# EAGLE design VIVA Blue Screen REV1-2 (EAGLE 6.3)

## Sheet 1 of 2
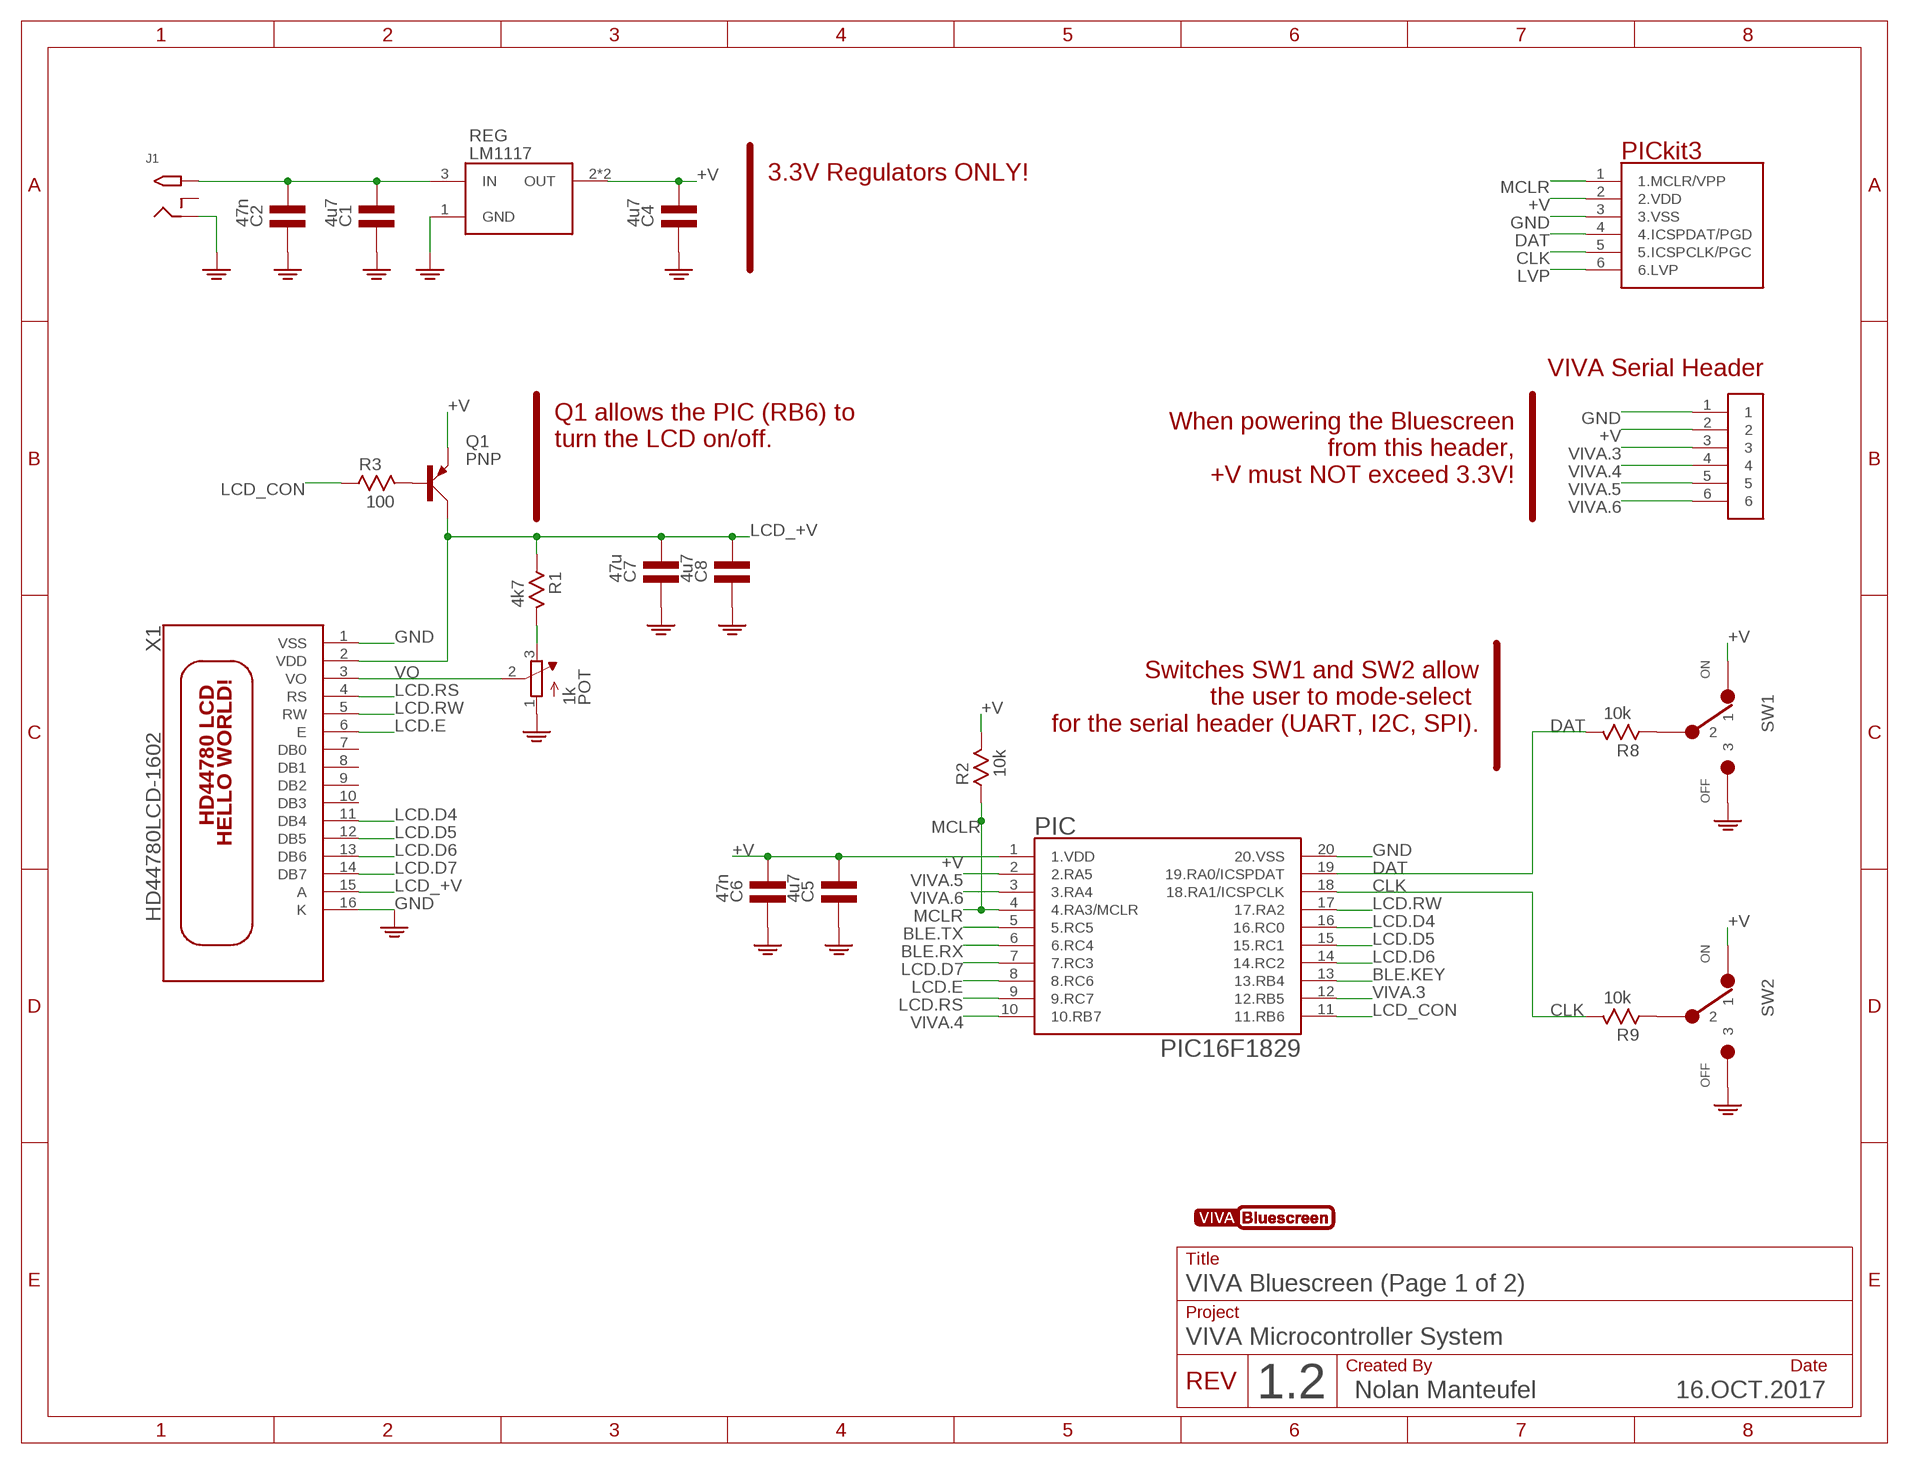
[diagram p0: schematic, sheet 1]

### Parts
C1  4u7  C0805  [C0805]
C2  47n  C0805  [C0805]
C4  4u7  C0805  [C0805]
C5  4u7  C0805  [C0805]
C6  47n  C0805  [C0805]
C7  47u  C0805  [C0805]
C8  4u7  C0805  [C0805]
J1  2.1MMJACKTHM  [PJ-102A]
J3  PICKIT3  [PINS_6_PICKIT3]
PIC  PIC16F1829  [SOP20-NEW]
POT  1k  TRIMPOTTC33X  [TC33X]
Q1  PNP  2N3906SOT23  [SOT23]
R1  4k7  R0805  [R0805]
R2  10k  R0805  [R0805]
R3  100  R0805  [R0805]
R8  10k  R0805  [R0805]
R9  10k  R0805  [R0805]
REG  LM1117  REGULATOR_SCHLM1117  [SOT223]
SW1  SWITCH-SPDT100PITCH  [SWITCH-SPDT]
SW2  SWITCH-SPDT100PITCH  [SWITCH-SPDT]
U$1  VIVA_BLUESCREEN_LOGO  [VIVA_BLUESCREEN_LOGO]
U$3  PINS_6SQUARE  [PINS_6]
X1  HD44780LCD-1602  [LCD1602]

### Nets
+V: C4.2 C5.2 C6.2 J3.2(2.VDD) PIC.1(1.VDD) Q1.2(E) R2.2 REG.2(OUT) REG.4.TAB(OUT) SW1.1 SW2.1 U$3.2 ; also sheet 2
BLE.KEY: PIC.13(13.RB4) ; also sheet 2
BLE.RX: PIC.6(6.RC4) ; also sheet 2
BLE.TX: PIC.5(5.RC5) ; also sheet 2
CLK: J3.5(5.ICSPCLK/PGC) PIC.18(18.RA1/ICSPCLK) R9.2
DAT: J3.4(4.ICSPDAT/PGD) PIC.19(19.RA0/ICSPDAT) R8.2
GND: C1.1 C2.1 C4.1 C5.1 C6.1 C7.1 C8.1 J1.RING J3.3(3.VSS) PIC.20(20.VSS) POT.1(A) REG.1(GND) SW1.3 SW2.3 U$3.1 X1.1(VSS) X1.16(K) ; also sheet 2
LCD.D4: PIC.16(16.RC0) X1.11(DB4)
LCD.D5: PIC.15(15.RC1) X1.12(DB5)
LCD.D6: PIC.14(14.RC2) X1.13(DB6)
LCD.D7: PIC.7(7.RC3) X1.14(DB7)
LCD.E: PIC.8(8.RC6) X1.6(E)
LCD.RS: PIC.9(9.RC7) X1.4(RS)
LCD.RW: PIC.17(17.RA2) X1.5(RW)
LCD_+V: C7.2 C8.2 Q1.3(C) R1.1 X1.2(VDD) X1.15(A)
LCD_CON: PIC.11(11.RB6) R3.1
LVP: J3.6(6.LVP)
MCLR: J3.1(1.MCLR/VPP) PIC.4(4.RA3/MCLR) R2.1
N$1: POT.3(E) R1.2
N$2: C1.2 C2.2 J1.TIP REG.3(IN)
N$4: Q1.1(B) R3.2
N$8: R8.1 SW1.2
N$12: R9.1 SW2.2
VIVA.3: PIC.12(12.RB5) U$3.3
VIVA.4: PIC.10(10.RB7) U$3.4
VIVA.5: PIC.2(2.RA5) U$3.5
VIVA.6: PIC.3(3.RA4) U$3.6
VO: POT.2(S) X1.3(VO)
Unconnected: J1.RING_SW X1.7(DB0) X1.8(DB1) X1.9(DB2) X1.10(DB3)

### Notes on the sheet
- 3.3V Regulators ONLY!
- VIVA Serial Header
- When powering the Bluescreen
  from this header,
  +V must NOT exceed 3.3V!
- Q1 allows the PIC (RB6) to
  turn the LCD on/off.
- Switches SW1 and SW2 allow
  the user to mode-select 
  for the serial header (UART, I2C, SPI).
- Title
- VIVA Bluescreen (Page 1 of 2)
- Project
- VIVA Microcontroller System
- Created By | Date
- 16.OCT.2017
- REV
- 1.2 | Nolan Manteufel

## Sheet 2 of 2
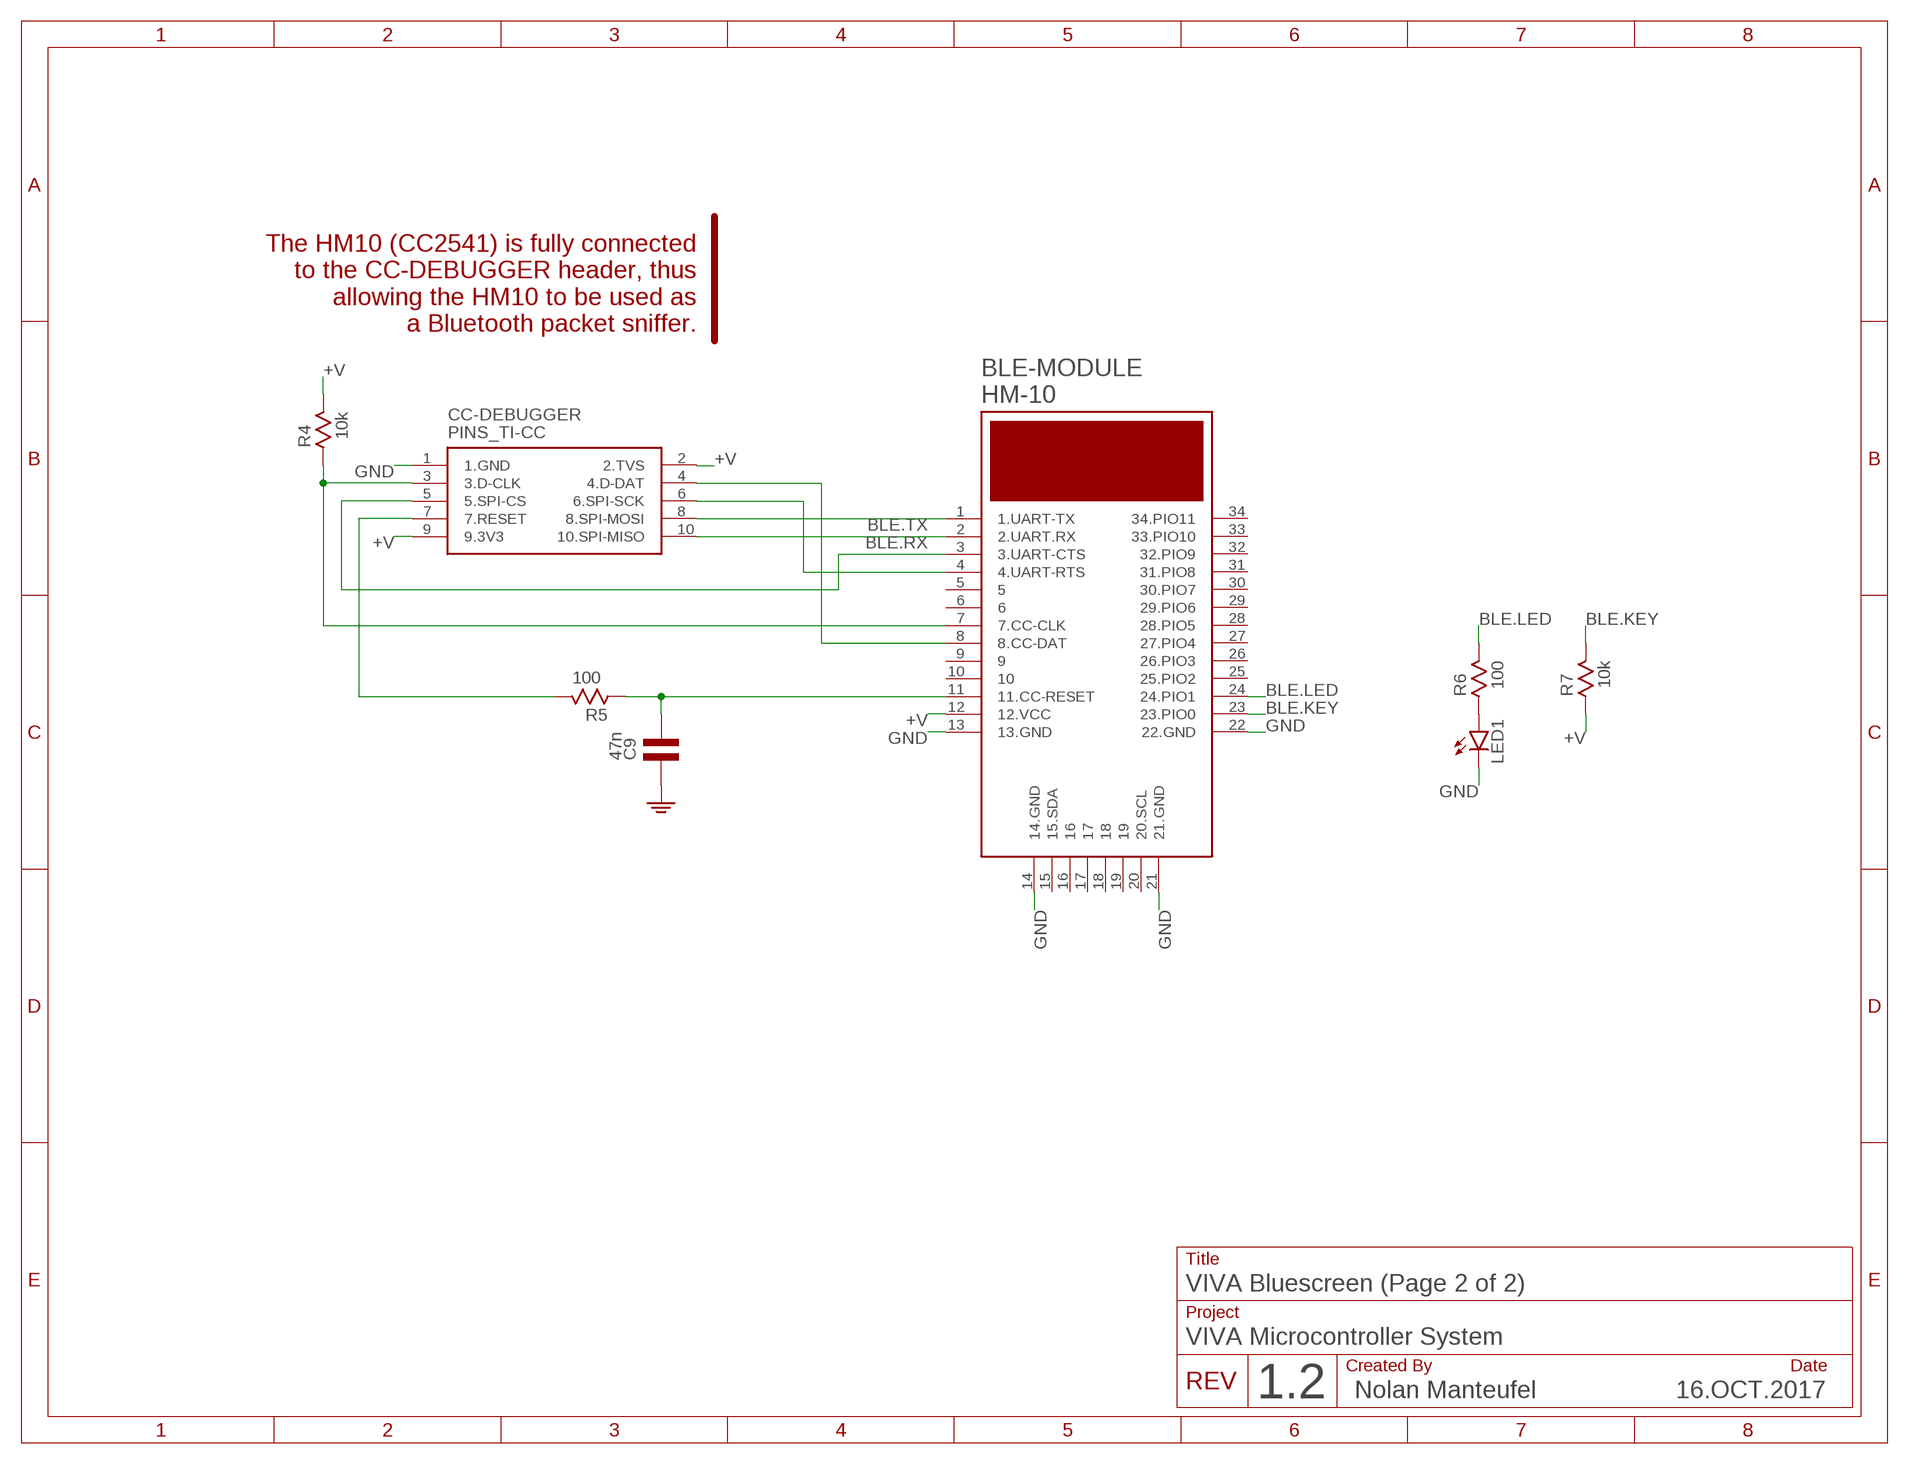
[diagram p1: schematic, sheet 2]

### Parts
BLE-MODULE  HM-10  HM-10EDGE  [HM-10_EDGE]
C9  47n  C0805  [C0805]
CC-DEBUGGER  PINS_TI-CC  [PINS_10-2X5]
LED1  LEDCHIP-LED0805  [CHIP-LED0805]
R4  10k  R0805  [R0805]
R5  100  R0805  [R0805]
R6  100  R0805  [R0805]
R7  10k  R0805  [R0805]

### Nets
+V: BLE-MODULE.12(12.VCC) CC-DEBUGGER.2(2.TVS) CC-DEBUGGER.9(9.3V3) R4.2 R7.1 ; also sheet 1
BLE.KEY: BLE-MODULE.23(23.PIO0) R7.2 ; also sheet 1
BLE.LED: BLE-MODULE.24(24.PIO1) R6.2
BLE.RX: BLE-MODULE.2(2.UART.RX) CC-DEBUGGER.10(10.SPI-MISO) ; also sheet 1
BLE.TX: BLE-MODULE.1(1.UART-TX) CC-DEBUGGER.8(8.SPI-MOSI) ; also sheet 1
GND: BLE-MODULE.13(13.GND) BLE-MODULE.14(14.GND) BLE-MODULE.21(21.GND) BLE-MODULE.22(22.GND) C9.1 CC-DEBUGGER.1(1.GND) LED1.C ; also sheet 1
N$3: LED1.A R6.1
N$5: BLE-MODULE.8(8.CC-DAT) CC-DEBUGGER.4(4.D-DAT)
N$6: BLE-MODULE.4(4.UART-RTS) CC-DEBUGGER.6(6.SPI-SCK)
N$7: BLE-MODULE.11(11.CC-RESET) C9.2 R5.1
N$9: CC-DEBUGGER.7(7.RESET) R5.2
N$10: BLE-MODULE.3(3.UART-CTS) CC-DEBUGGER.5(5.SPI-CS)
N$11: BLE-MODULE.7(7.CC-CLK) CC-DEBUGGER.3(3.D-CLK) R4.1
Unconnected: BLE-MODULE.5 BLE-MODULE.6 BLE-MODULE.9 BLE-MODULE.10 BLE-MODULE.15(15.SDA) BLE-MODULE.16 BLE-MODULE.17 BLE-MODULE.18 BLE-MODULE.19 BLE-MODULE.20(20.SCL) BLE-MODULE.25(25.PIO2) BLE-MODULE.26(26.PIO3) BLE-MODULE.27(27.PIO4) BLE-MODULE.28(28.PIO5) BLE-MODULE.29(29.PIO6) BLE-MODULE.30(30.PIO7) BLE-MODULE.31(31.PIO8) BLE-MODULE.32(32.PIO9) BLE-MODULE.33(33.PIO10) BLE-MODULE.34(34.PIO11)

### Notes on the sheet
- The HM10 (CC2541) is fully connected
  to the CC-DEBUGGER header, thus
  allowing the HM10 to be used as
  a Bluetooth packet sniffer.
- Title
- VIVA Bluescreen (Page 2 of 2)
- Project
- VIVA Microcontroller System
- Created By | Date
- 16.OCT.2017
- REV
- 1.2 | Nolan Manteufel

## Library data of the parts
BLE-MODULE = nolan-utsa:HM-10
C1 C2 C4-C9 = nolan-utsa:C
CC-DEBUGGER = nolan-utsa:PINS_TI-CC
J1 = nolan-utsa:2.1MMJACK: 2.1mm x 5.5mm THM DC jack with internal switch. Digikey part #PJ-102A, 4UCON part #05537 2.1mm x 5.5mm SMT DC jack with internal switch. Digikey part #PJ-002A-SMT, 4UCON part #03267 By microbuilder.eu & adafruit.com
J3 = nolan-utsa:PICKIT3
LED1 = nolan-utsa:LED: LED OSRAM: - CHIPLED LG R971, LG N971, LY N971, LG Q971, LY Q971, LO R971, LY R971 LH N974, LH R974 LS Q976, LO Q976, LY Q976 LO Q996 - Hyper CHIPLED LW Q18S LB Q993, LB Q99A, LB R99A - SideLED LS A670, LO A670, LY A670, LG A670, LP A670 LB A673, LV A673, LT A673, LW A673 LH A674 LY A675 LS A676, LA A676, LO A676, LY A676, LW A676 LS A679, LY A679, LG A679 - Hyper Micro SIDELED® LS Y876, LA Y876, LO Y876, LY Y876 LT Y87S - SmartLED LW L88C, LW L88S LB L89C, LB L89S, LG L890 LS L89K, LO L89K, LY L89K LS L896, LA L896, LO L896, LY L896 - TOPLED LS T670, LO T670, LY T670, LG T670, LP T670 LSG T670, LSP T670, LSY T670, LOP T670, LYG T670 LG T671, LOG T671, LSG T671 LB T673, LV T673, LT T673, LW T673 LH T674 LS T676, LA T676, LO T676, LY T676, LB T676, LH T676, LSB T676, LW T676 LB T67C, LV T67C, LT T67C, LS T67K, LO T67K, LY T67K, LW E67C LS E67B, LA E67B, LO E67B, LY E67B, LB E67C, LV E67C, LT E67C LW T67C LS T679, LY T679, LG T679 LS T770, LO T770, LY T770, LG T770, LP T770 LB T773, LV T773, LT T773, LW T773 LH T774 LS E675, LA E675, LY E675, LS T675 LS T776, LA T776, LO T776, LY T776, LB T776 LHGB T686 LT T68C, LB T68C - Hyper Mini TOPLED® LB M676 - Mini TOPLED Santana® LG M470 LS M47K, LO M47K, LY M47K Source: http://www.osram.convergy.de LUXEON: - LUMILED® LXK2-PW12-R00, LXK2-PW12-S00, LXK2-PW14-U00, LXK2-PW14-V00 LXK2-PM12-R00, LXK2-PM12-S00, LXK2-PM14-U00 LXK2-PE12-Q00, LXK2-PE12-R00, LXK2-PE12-S00, LXK2-PE14-T00, LXK2-PE14-U00 LXK2-PB12-K00, LXK2-PB12-L00, LXK2-PB12-M00, LXK2-PB14-N00, LXK2-PB14-P00, LXK2-PB14-Q00 LXK2-PR12-L00, LXK2-PR12-M00, LXK2-PR14-Q00, LXK2-PR14-R00 LXK2-PD12-Q00, LXK2-PD12-R00, LXK2-PD12-S00 LXK2-PH12-R00, LXK2-PH12-S00 LXK2-PL12-P00, LXK2-PL12-Q00, LXK2-PL12-R00 Source: www.luxeon.com KINGBRIGHT: KA-3528ASYC Source: www.kingbright.com
PIC = nolan-utsa:PIC16F1829
POT = nolan-utsa:TRIMPOT: SMT trimmer potentiometer part number TC33X http://www.ladyada.net/library/eagle
Q1 = nolan-utsa:2N3906: PNP TRANSISTOR
R1-R9 = nolan-utsa:R
REG = nolan-utsa:REGULATOR_SCH: Linear Regulator in SOT-223 package. NOTE: select correct pinout for your application. Tab may be OUT or GND!
SW1 SW2 = nolan-utsa:SWITCH-SPDT
U$1 = nolan-utsa:VIVA_BLUESCREEN_LOGO
U$3 = nolan-utsa:PINS_6
X1 = nolan-utsa:HD44780LCD: HD44780 LCD Standard character type LCDs, available in sizes from 8x1 to 40x4!

## Board
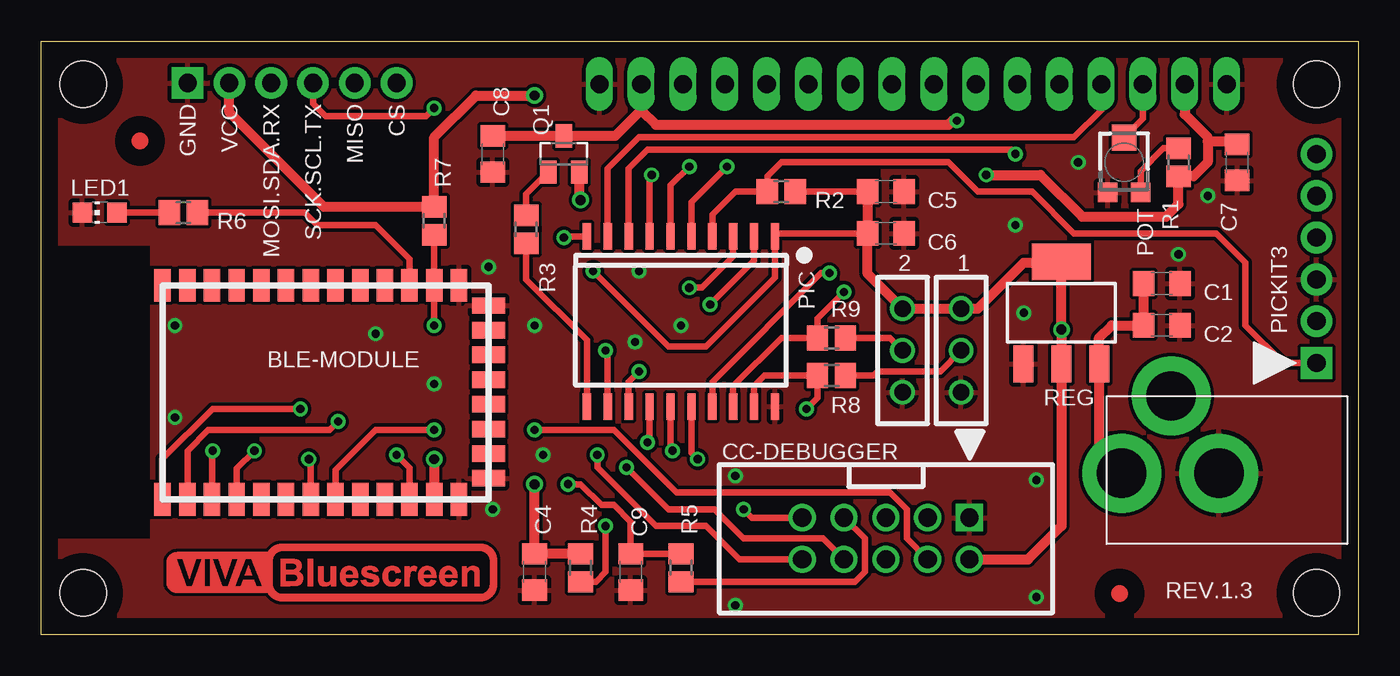
[diagram p2: board, top side]
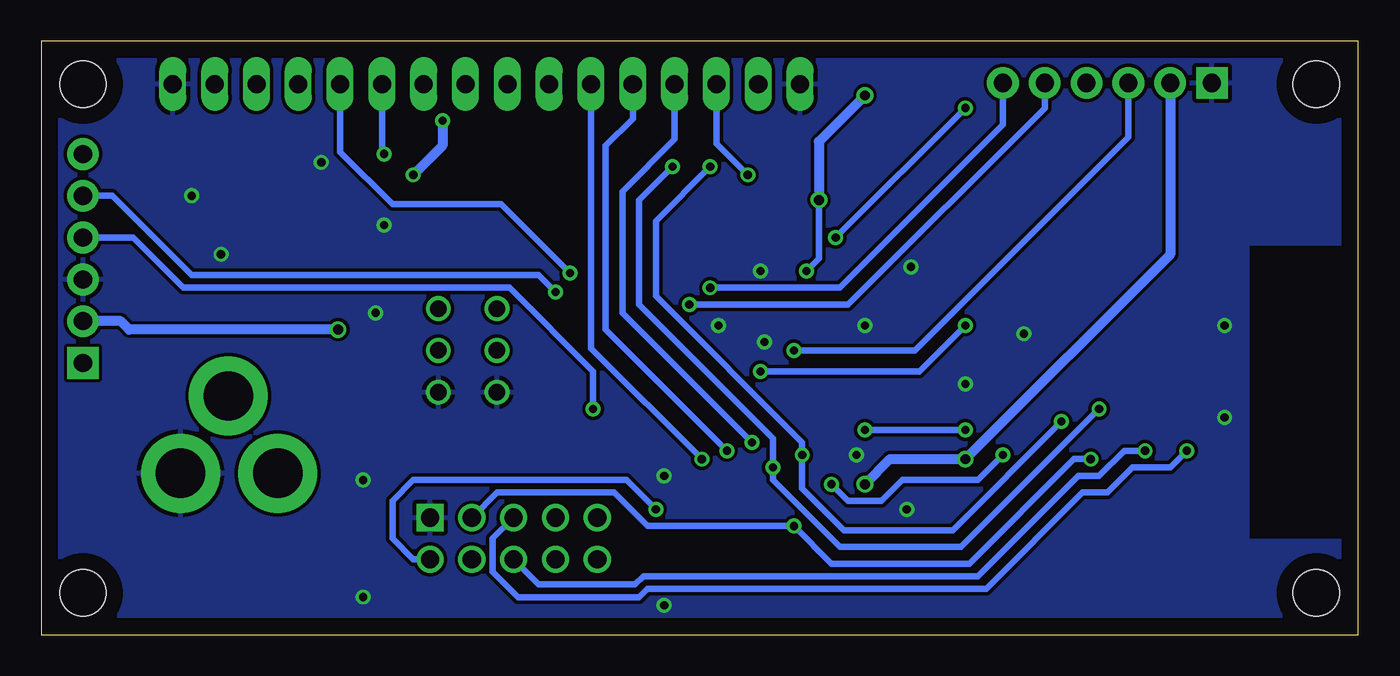
[diagram p3: board, bottom side, seen from below]

Size 80.01 x 36.07 mm. Coordinates in mm from the lower left corner, seen from the top.
Outline: 80.01,0 0,0 0,36.07 80.01,36.07 80.01,0
Copper layers (1*16): Top 0.035mm / dielectric 1.5mm / Bottom 0.035mm
Design rules "default *": minimum track width 10mil, minimum drill 24mil, track to track 8mil, track to pad 8mil, pad to pad 8mil, via to via 8mil, smd to smd 8mil, copper to edge 40mil, drill to drill 8mil, minimum pad ring 10mil, minimum via ring 8mil, stop-mask expansion 4mil, vias tented up to drill 20mil, thermal gap 10mil
tKeepout: area 64,1 to 67,4; area 4.5,28.5 to 7.5,31.5
tRestrict: area 1,5.8 to 6.6,23.6; area 64,1 to 67,4; area 4.5,28.5 to 7.5,31.5; 2 lines
bRestrict: area 1,5.8 to 6.6,23.6

### Footprints (pad centres in the part's own frame; a part is rotated, then mirrored left to right if it is on the bottom)
HM-10_EDGE = smd 2 x 1: 1 -6.5,6.34; 2 -6.5,4.84; 3 -6.5,3.34; 4 -6.5,1.84; 5 -6.5,0.34; 6 -6.5,-1.16; 7 -6.5,-2.66; 8 -6.5,-4.16; 9 -6.5,-5.66; 10 -6.5,-7.16; 11 -6.5,-8.66; 12 -6.5,-10.16; 13 -6.5,-11.66; 22 6.5,-11.66; 23 6.5,-10.16; 24 6.5,-8.66; 25 6.5,-7.16; 26 6.5,-5.66; 27 6.5,-4.16; 28 6.5,-2.66; 29 6.5,-1.16; 30 6.5,0.34; 31 6.5,1.84; 32 6.5,3.34; 33 6.5,4.84; 34 6.5,6.34 | smd 1 x 2: 14 -5.23,-13.45; 15 -3.73,-13.45; 16 -2.23,-13.45; 17 -0.73,-13.45; 18 0.77,-13.45; 19 2.27,-13.45; 20 3.77,-13.45; 21 5.27,-13.45
C0805 = smd 1.3 x 1.5: 1 -1.104,0; 2 1.104,0
PINS_10-2X5 = drill 1.1 square: 1 -1.27,5.08 | drill 1.1: 2 1.27,5.08; 3 -1.27,2.54; 4 1.27,2.54; 5 -1.27,0; 6 1.27,0; 7 -1.27,-2.54; 8 1.27,-2.54; 9 -1.27,-5.08; 10 1.27,-5.08
PJ-102A = drill 3 pad 4.8: RING 0.1,-3.39; RING_SW -4.6,-6.29; TIP 0.1,-9.29
PINS_6_PICKIT3 = drill 1.1 pad 1.93 square: 1 0,0 | drill 1.1 pad 1.93: 2 0,-2.54; 3 0,-5.08; 4 0,-7.62; 5 0,-10.16; 6 0,-12.7
CHIP-LED0805 = smd 1.2 x 1.2: A 0,-1.05; C 0,1.05
SOP20-NEW = smd 0.5 x 1.6: 1 -5.715,-5.152; 2 -4.445,-5.152; 3 -3.175,-5.152; 4 -1.905,-5.152; 5 -0.635,-5.152; 6 0.635,-5.152; 7 1.905,-5.152; 8 3.175,-5.152; 9 4.445,-5.152; 10 5.715,-5.152; 11 5.715,5.188; 12 4.445,5.188; 13 3.175,5.188; 14 1.905,5.188; 15 0.635,5.188; 16 -0.635,5.188; 17 -1.905,5.188; 18 -3.175,5.188; 19 -4.445,5.188; 20 -5.715,5.188
TC33X = smd 1.2 x 1.2: 1 -1,-1.825; 3 1,-1.825 | smd 1.5 x 1.6: 2 0,1.5
SOT23 = smd 1 x 1.4: 1 -0.95,-1.1; 2 0.95,-1.1; 3 0,1.1
R0805 = smd 1.3 x 1.5: 1 -0.85,0; 2 0.85,0
SOT223 = smd 1.219 x 2.235: 1 -2.311,-3.099; 2 0,-3.099; 3 2.311,-3.099 | smd 3.6 x 2.2: 4.TAB 0,3.099
SWITCH-SPDT = drill 1: 1 0,2.54; 2 0,0; 3 0,-2.54
PINS_6 = drill 1.1 pad 1.93 square: 1 0,0 | drill 1.1 pad 1.93: 2 2.54,0; 3 5.08,0; 4 7.62,0; 5 10.16,0; 6 12.7,0
LCD1602 = drill 1.1 long: 1 8,33.46; 2 10.54,33.46; 3 13.08,33.46; 4 15.62,33.46; 5 18.16,33.46; 6 20.7,33.46; 7 23.24,33.46; 8 25.78,33.46; 9 28.32,33.46; 10 30.86,33.46; 11 33.4,33.46; 12 35.94,33.46; 13 38.48,33.46; 14 41.02,33.46; 15 43.56,33.46; 16 46.1,33.46 | hole 2.8: 2.54,2.54; 2.54,33.46; 77.46,33.46; 77.46,2.54

### Placement (x,y rotation side)
BLE-MODULE  13.72,14.73 90 top
C1  68.07,21.34 180 top
C2  68.07,18.8 180 top
C4  29.97,3.81 90 top
C5  51.31,26.92 180 top
C6  51.31,24.38 180 top
C7  72.64,28.7 90 top
C8  27.43,29.21 90 top
C9  35.81,3.81 90 top
CC-DEBUGGER  51.31,5.84 270 top
J1  74.93,9.91 270 top
J3  77.47,16.51 180 top
LED1  3.56,25.65 90 top
PIC  38.86,19.05 180 top
POT  65.79,28.7 0 top
Q1  31.75,29.21 0 top
R1  69.09,28.7 90 top
R2  44.96,26.92 0 top
R3  29.46,24.64 90 top
R4  32.77,4.06 90 top
R5  38.86,4.06 270 top
R6  8.64,25.65 0 top
R7  23.88,25.15 270 top
R8  48.01,15.75 180 top
R9  48.01,18.03 180 top
REG  61.98,19.56 0 top
SW1  55.88,17.27 0 top
SW2  52.32,17.27 0 top
U$1  7.62,2.03 0 top
U$3  8.89,33.53 0 top
X1  80.01,0 0 bottom

### Tracks (layer width: path | path; a pad name or v marks a point on that pad's centre or on a via)
+V  (via drill 0.5, 0.6)
  Top 0.406: R2.2 C5.2 | CC-DEBUGGER.9 43.18,7.11 v42.67,7.62 | v33.53,22.1 38.1,17.53 40.39,17.53 44.58,21.72 PIC.1 44.76,24.38 C6.2
  Top 0.61: 32.85,28.11 Q1.2 32.7,26.48 v32.77,26.42 | v23.88,10.67 BLE-MODULE.12 | U$3.2 11.43,31.75 17.18,26 R7.1 23.88,30.23 26.42,32.77 v29.97,32.77 | CC-DEBUGGER.2 59.94,4.57 61.98,6.6 REG.2 v61.98,18.54 REG.4.TAB 61.92,22.61 59.69,22.61 56.9,19.81 SW1.1 SW2.1 50.2,21.93 C6.2 C5.2 | R4.2 C4.2 v29.97,9.14
  Bottom 0.406: v42.67,7.62 44.45,9.4 57.4,9.4 58.67,8.13 58.67,5.84 57.4,4.57 CC-DEBUGGER.2 | v32.77,26.42 32.77,22.86 v33.53,22.1
  Bottom 0.61: v29.97,9.14 28.45,10.67 v23.88,10.67 11.43,23.11 U$3.2 | v29.97,32.77 32.77,29.97 v32.77,26.42 | v61.98,18.54 74.68,18.54 75.18,19.05 J3.2
BLE.KEY  (via drill 0.5)
  Top 0.406: PIC.13 35.69,15.37 v36.32,16 | v23.88,18.8 BLE-MODULE.23 R7.2
  Bottom 0.406: v36.32,16 26.67,16 v23.88,18.8
BLE.LED
  Top 0.406: R6.2 16,25.65 16.76,24.89 20.32,24.89 22.38,22.84 BLE-MODULE.24
BLE.RX  (via drill 0.5)
  Top 0.406: PIC.6 38.23,27.3 v39.37,28.45 | BLE-MODULE.2 8.89,8.25 8.89,11.18 10.16,12.45 17.53,12.45 v18.03,12.95 | CC-DEBUGGER.10 42.42,4.57 40.39,6.6 37.34,6.6 33.78,10.16 v33.78,10.92
  Bottom 0.406: v39.37,28.45 42.67,25.15 42.67,20.57 33.78,11.68 v33.78,10.92 33.78,8.89 31.24,6.35 24.64,6.35 v18.03,12.95
BLE.TX  (via drill 0.5)
  Top 0.406: PIC.5 39.5,26.29 v41.66,28.45 | BLE-MODULE.1 7.37,8.24 7.37,10.67 10.41,13.72 v15.75,13.72 | CC-DEBUGGER.8 47.5,5.84 42.67,5.84 40.89,7.62 38.1,7.62 v35.56,10.16
  Bottom 0.406: v41.66,28.45 43.69,26.42 43.69,20.07 35.56,11.94 v35.56,10.16 35.56,9.4 31.5,5.33 24.13,5.33 v15.75,13.72
CLK  (via drill 0.5)
  Top 0.406: PIC.18 42.04,15.11 44.96,18.03 R9.2 47.16,19.22 v48.77,20.83
  Bottom 0.406: J3.5 75.69,26.67 70.87,21.84 49.78,21.84 v48.77,20.83
DAT  (via drill 0.5)
  Top 0.406: PIC.19 43.31,15.11 43.94,15.75 R8.2 47.16,14.39 v46.48,13.72
  Bottom 0.406: J3.4 74.42,24.13 71.37,21.08 51.56,21.08 46.48,16 v46.48,13.72
GND  (via drill 0.5)
  other vias: 69.09,23.11 59.18,24.89 42.16,1.78 59.69,19.56 70.87,26.67 27.43,7.62 60.45,9.4 60.45,2.29 42.16,9.65 38.86,18.8 36.32,22.1 62.99,28.7 30.48,10.92 36.07,17.78 29.97,18.8 27.18,22.35 20.32,18.29 23.88,15.24 8.13,18.8 8.13,13.21
  pour Bottom: 80.01,0 0,0 0,36.07 80.01,36.07
  pour Top: 80.01,0 0,0 0,36.07 80.01,36.07
LCD.D4  (via drill 0.5)
  Top 0.406: v39.88,10.67 39.5,11.05 PIC.16
  Bottom 0.406: X1.11 46.61,17.4 v39.88,10.67
LCD.D5  (via drill 0.5)
  Top 0.406: v38.35,11.18 38.23,11.3 PIC.15
  Bottom 0.406: v38.35,11.18 45.72,18.54 45.72,29.72 44.07,31.37 X1.12
LCD.D6  (via drill 0.5)
  Top 0.406: v36.83,11.68 36.96,11.81 PIC.14
  Bottom 0.406: v36.83,11.68 44.7,19.56 44.7,26.92 41.53,30.1 X1.13
LCD.D7  (via drill 0.5)
  Top 0.406: PIC.7 36.96,27.56 v37.08,27.94
  Bottom 0.406: X1.14 38.99,29.85 v37.08,27.94
LCD.E  (via drill 0.5)
  Top 0.406: PIC.8 35.69,28.32 36.83,29.46 58.93,29.46 v59.18,29.21
  Bottom 0.406: X1.6 59.31,29.34 v59.18,29.21
LCD.RS
  Top 0.406: X1.4 64.39,31.88 62.74,30.23 36.32,30.23 34.42,28.32 PIC.9
LCD.RW  (via drill 0.5)
  Top 0.406: PIC.17 40.77,15.37 47.37,21.97 v47.88,21.97
  Bottom 0.406: v47.88,21.97 52.07,26.16 58.67,26.16 61.85,29.34 X1.5
LCD_+V  (via drill 0.5)
  Top 0.61: v55.63,31.24 55.37,31.24 55.12,30.99 37.34,30.99 36.45,31.88 X1.15 36.45,31.88 34.88,30.31 Q1.3 C8.2 | v57.4,27.94 60.71,27.94 63.25,25.4 68.33,25.4 69.09,26.16 R1.1 70.02,27.85 70.87,28.7 70.87,29.97 | X1.2 69.47,31.62 70.87,30.23 70.87,29.97 | C7.2 72.48,29.97 70.87,29.97
  Bottom 0.61: v55.63,31.24 55.63,29.72 v57.4,27.94
LCD_CON
  Top 0.406: PIC.11 33.15,17.91 29.46,21.59 R3.1
MCLR
  Top 0.406: PIC.4 40.77,25.53 42.16,26.92 R2.1 44.11,27.85 44.96,28.7 55.12,28.7 56.9,26.92 60.2,26.92 62.74,24.38 71.37,24.38 73.15,22.61 73.15,18.8 75.44,16.51 J3.1
N$1
  Top 0.406: POT.3 66.79,28.18 68.16,29.55 R1.2
N$2
  Top 0.61: J1.TIP 64.29,11.16 REG.3 64.26,16.48 64.26,18.03 65.02,18.8 C2.2 C1.2
N$3
  Top 0.406: LED1.A R6.1
N$4
  Top 0.406: R3.2 29.46,26.77 Q1.1
N$5  (via drill 0.5)
  Top 0.406: BLE-MODULE.8 17.88,10 20.32,12.45 v23.88,12.45 | CC-DEBUGGER.4 52.58,5.84 52.58,7.62 51.56,8.64 38.61,8.64 34.8,12.45 v29.97,12.45
  Bottom 0.406: v23.88,12.45 v29.97,12.45
N$6  (via drill 0.5)
  Top 0.406: BLE-MODULE.4 11.88,10.1 v12.95,11.18
  Bottom 0.406: v12.95,11.18 14.22,11.18 15.75,9.65 17.02,9.65 23.11,3.56 43.43,3.56 43.94,3.05 49.78,3.05 CC-DEBUGGER.6
N$7  (via drill 0.5)
  Top 0.406: R5.1 C9.2 35.81,6.86 34.8,7.87 34.04,7.87 32.77,9.14 v32,9.14 | BLE-MODULE.11 22.38,10.14 v21.59,10.92
  Bottom 0.406: v21.59,10.92 23.11,9.4 27.69,9.4 28.96,8.13 30.99,8.13 v32,9.14
N$8
  Top 0.406: R8.1 50.55,15.75 50.8,16 54.61,16 SW1.2
N$9
  Top 0.406: R5.2 49.44,3.21 50.04,3.81 50.04,5.84 CC-DEBUGGER.7
N$10  (via drill 0.5)
  Top 0.406: BLE-MODULE.3 10.38,11.14 v10.41,11.18
  Bottom 0.406: v10.41,11.18 11.43,10.16 13.72,10.16 15.24,8.64 16.76,8.64 22.61,2.79 43.18,2.79 43.69,2.29 51.05,2.29 52.58,3.81 52.58,5.84 CC-DEBUGGER.5
N$11  (via drill 0.5)
  Top 0.406: BLE-MODULE.7 16.38,10.55 v16.26,10.67 | R4.1 33.69,3.21 34.29,3.81 v34.29,6.6
  Bottom 0.406: v16.26,10.67 17.27,10.67 23.62,4.32 32,4.32 v34.29,6.6 43.18,6.6 45.21,8.64 52.32,8.64 CC-DEBUGGER.3
N$12
  Top 0.406: R9.1 51.56,18.03 SW2.2
VIVA.3  (via drill 0.5)
  Top 0.406: PIC.12 34.42,17.14 v34.29,17.27
  Bottom 0.406: v34.29,17.27 26.92,17.27 13.97,30.23 U$3.3
VIVA.4  (via drill 0.5)
  Top 0.406: PIC.10 31.82,24.2 v31.75,24.13 | v23.88,32 23.37,31.5 17.27,31.5 16.51,32.26 U$3.4
  Bottom 0.406: v31.75,24.13 v23.88,32
VIVA.5  (via drill 0.5)
  Top 0.406: PIC.2 43.31,22.73 v40.64,20.07
  Bottom 0.406: v40.64,20.07 30.99,20.07 19.05,32 U$3.5
VIVA.6  (via drill 0.5)
  Top 0.406: PIC.3 42.04,22.99 40.13,21.08 v39.37,21.08
  Bottom 0.406: v39.37,21.08 31.5,21.08 21.59,30.99 U$3.6
VO
  Top 0.406: POT.2 66.93,31.35 X1.3
(copper drawn outside any net)
  shapes: Top circle x2

### Text on the board
tPlace: GND | VCC | MOSI.SDA.RX | SCK.SCL.TX | MISO | CS | 2 | 1 | REV.1.3